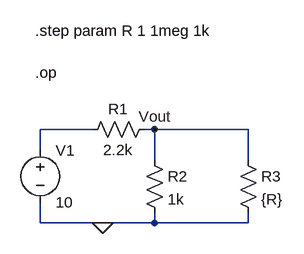
[diagram p0: schematic Draft1.asc]
Draft1.asc, the LTspice schematic file:
Version 4
SHEET 1 880 680
WIRE 192 16 112 16
WIRE 288 16 272 16
WIRE 432 16 288 16
WIRE 112 48 112 16
WIRE 288 64 288 16
WIRE 432 64 432 16
WIRE 112 160 112 128
WIRE 208 160 112 160
WIRE 288 160 288 144
WIRE 288 160 208 160
WIRE 432 160 432 144
WIRE 432 160 288 160
FLAG 208 160 0
FLAG 288 16 Vout
SYMBOL res 272 48 R0
SYMATTR InstName R2
SYMATTR Value 1k
SYMBOL res 288 0 R90
WINDOW 0 0 56 VBottom 2
WINDOW 3 32 56 VTop 2
SYMATTR InstName R1
SYMATTR Value 2.2k
SYMBOL voltage 112 32 R0
WINDOW 123 0 0 Left 2
WINDOW 39 0 0 Left 2
SYMATTR InstName V1
SYMATTR Value 10
SYMBOL res 416 48 R0
SYMATTR InstName R3
SYMATTR Value {R}
TEXT 104 -72 Left 2 !.op
TEXT 104 -136 Left 2 !.step param R 1 1meg 1k

The netlist it stands for:
* Draft1.asc
R2 Vout 0 1k
R1 Vout N001 2.2k
V1 N001 0 10
R3 Vout 0 {R}
.op
.step param R 1 1meg 1k
.backanno
.end

* Results of the author's LTspice run, read from the files saved beside the schematic
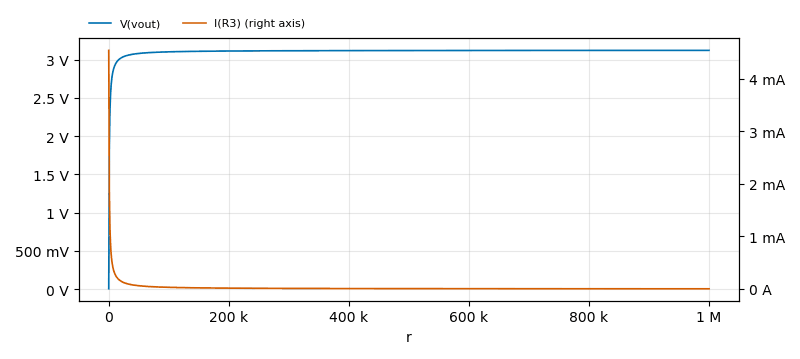
[diagram p1: Operating Point of Draft1.asc, plotted from the saved traces]
* Operating Point, 1 run:
*   V(vout): 4.539 mV at r=1 , 3.123 V at r=1 M, min 4.539 mV, max 3.123 V
*   I(R3): 4.539 mA at r=1 , 3.123 µA at r=1 M, min 3.123 µA, max 4.539 mA